# Altium schematic sheet [5] Power, DWIN.SchDoc
size A4; DocumentNumber: 8; SheetNumber: 8; SheetTotal: 10
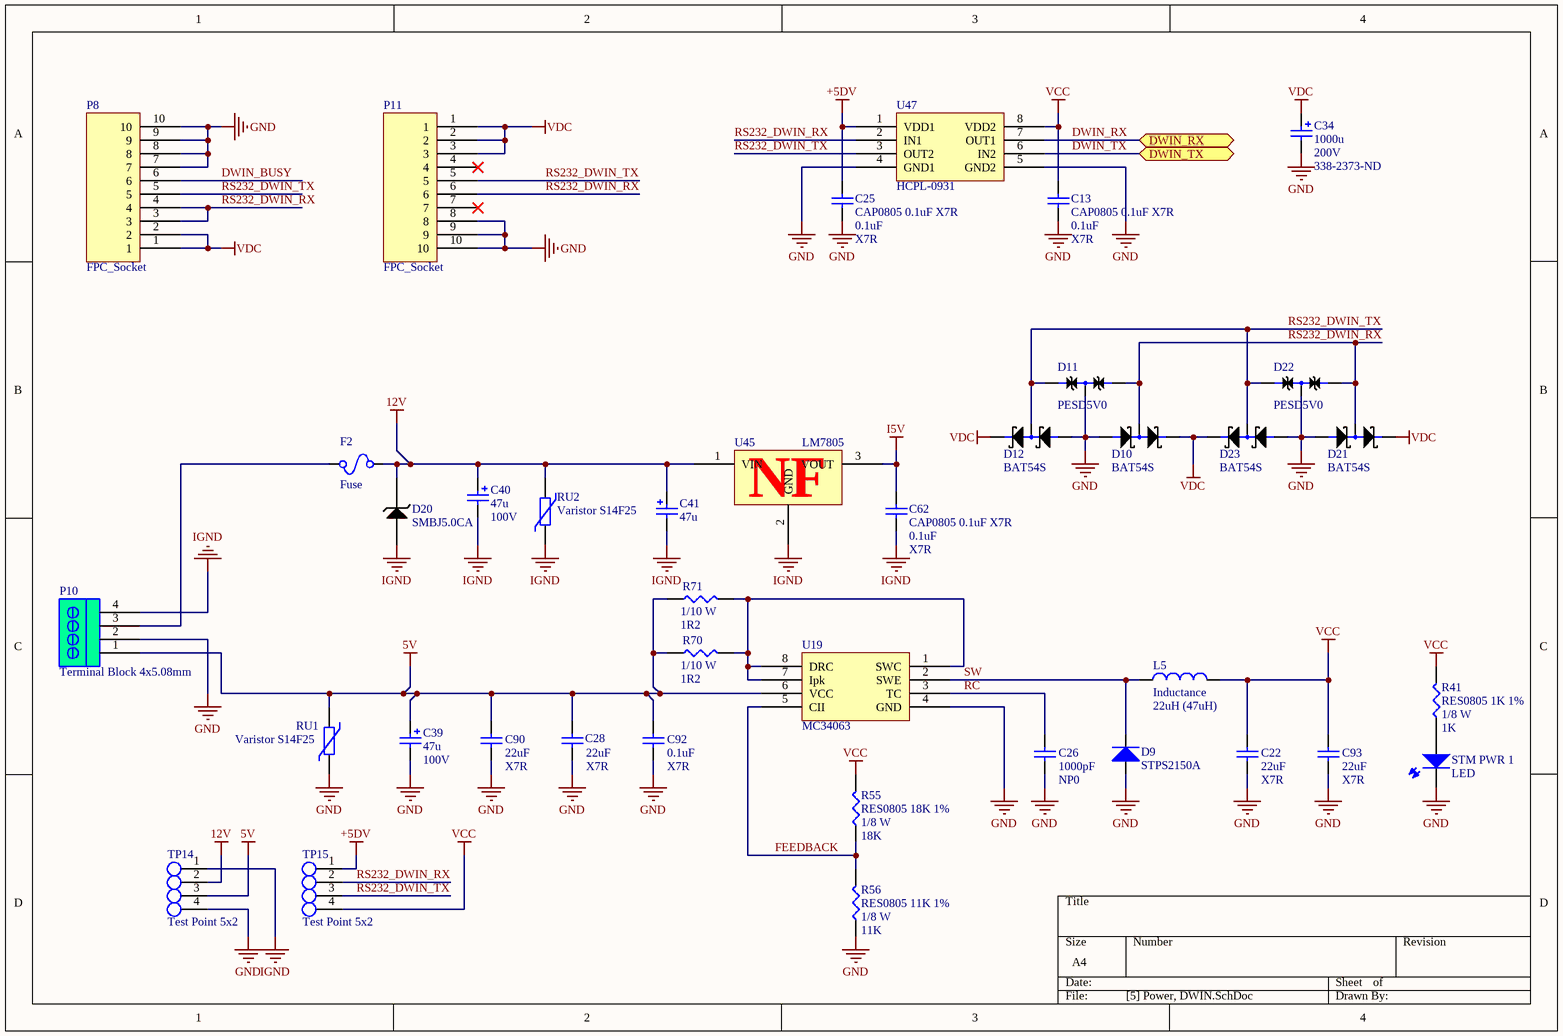
[diagram p0: [5] Power, DWIN.SchDoc]

## Parts
C13  CAP0805 0.1uF X7R  value 0.1uF  Type: X7R  [CAP0805]
C22  value 22uF  Type: X7R  [CAP1210]  (hidden comment: ChipCap 22u X7R)
C25  CAP0805 0.1uF X7R  value 0.1uF  Type: X7R  [CAP0805]
C26  value 1000pF  Type: NP0  [CAP0805]  (hidden comment: CAP0805 1000pF NP0)
C28  value 22uF  Type: X7R  [CAP1210]  (hidden comment: ChipCap 22u X7R)
C34  value 1000u  Voltage: 200V  Supplier Part Number 1: 338-2373-ND  [CAPPR7.5-16x25_1]  (hidden comment: Cap Pol 200/100)
C39  value 47u  Voltage: 100V  [CAPPR5-10x17_1]  (hidden comment: Cap Pol 100/47)
C40  value 47u  Voltage: 100V  [CAPPR5-10x17_1]  (hidden comment: Cap Pol 100/47)
C41  value 47u  [CAPC7343]  (hidden comment: Cap Pol SMD)
C62  CAP0805 0.1uF X7R  value 0.1uF  Type: X7R  [CAP0805]
C90  value 22uF  Type: X7R  [CAP1210]  (hidden comment: ChipCap 22u X7R)
C92  value 0.1uF  Type: X7R  [CAP0603]  (hidden comment: ChipCap 0.1u X7R)
C93  value 22uF  Type: X7R  [CAP1210]  (hidden comment: ChipCap 22u X7R)
D9  STPS2150A  [DO-214AS]
D10  BAT54S  [SOT23]
D11  PESD5V0  [SOT23]
D12  BAT54S  [SOT23]
D20  SMBJ5.0CA  [DO-214AS]
D21  BAT54S  [SOT23]
D22  PESD5V0  [SOT23]
D23  BAT54S  [SOT23]
F2  Fuse  [PTC1812]
L5  Inductance  value 22uH (47uH)  [IHPL-3232]
P8  FPC_Socket  [MOLEX Header 8 2mm Pitch]
P10  Terminal Block 4x5.08mm  [Socket 4x5.08]
P11  FPC_Socket  [Molex FPC/FFC 10pin]
R41  RES0805 1K 1%  value 1K  Rating: 1/8 W  [RES0805]
R55  RES0805 18K 1%  value 18K  Rating: 1/8 W  [RES0805]
R56  RES0805 11K 1%  value 11K  Rating: 1/8 W  [RES0805]
R70  value 1R2  Rating: 1/10 W  [RES1206]  (hidden comment: ChipRes 1R2 1%)
R71  value 1R2  Rating: 1/10 W  [RES1206]  (hidden comment: ChipRes 1R2 1%)
RU1  Varistor S14F25  [S14K25]
RU2  Varistor S14F25  [S14K25]
STM_PWR_1  LED  [PLCC-2]
TP14  Test Point 5x2  [PG-1.5-13.5-4P-2.54PH]
TP15  Test Point 5x2  [PG-1.5-13.5-4P-2.54PH]
U19  MC34063  [SOP8]
U45  LM7805  [TO-220]
U47  HCPL-0931  [SOIC8]

## Ports
DWIN_RX, DWIN_TX

## Nets
5V: C28.2 C39.1 C90.2 C92.2 P10.1 R70.1 R71.1 RU1.2 TP14.3 U19.6(VCC)
12V: C40.1 C41.1 D20.1 F2.1 RU2.2 TP14.2 U45.1(VIN)
+5DV: C25.2 TP15.1 U47.1(VDD1)
GND: C13.1 C22.1 C25.1 C26.1 C28.1 C34.2 C39.2 C90.1 C92.1 C93.1 D9.1(A) D10.1 D11.3 D12.1 D21.1 D22.3 D23.1 P8.7 P8.8 P8.9 P8.10 P10.2 P11.8 P11.9 P11.10 R56.1 RU1.1 STM_PWR_1.1 TP14.4 U19.4(GND) U47.4(GND1) U47.5(GND2)
I5V: C62.2 U45.3(VOUT)
IGND: C40.2 C41.2 C62.1 D20.2 P10.4 RU2.1 TP14.1 U45.2(GND)
VCC: C13.2 C22.2 C93.2 L5.1 R41.2 R55.2 TP15.4 U47.8(VDD2)
VDC: C34.1 D10.2 D12.2 D21.2 D23.2 P8.1 P8.2 P11.1 P11.2 P11.3
DWIN_BUSY: P8.6
DWIN_RX: U47.7(OUT1) ; port DWIN_RX
DWIN_TX: U47.6(IN2) ; port DWIN_TX
FEEDBACK: R55.1 R56.2 U19.5(CII)
RC: C26.2 U19.3(TC)
RS232_DWIN_RX: D10.3 D11.2 D21.3 D22.2 P8.3 P8.4 P11.6 TP15.2 U47.2(IN1)
RS232_DWIN_TX: D11.1 D12.3 D22.1 D23.3 P8.5 P11.5 TP15.3 U47.3(OUT2)
SW: D9.2(K) L5.2 U19.2(SWE)
NetF2_2: F2.2 P10.3
NetR41_1: R41.1 STM_PWR_1.2
NetR70_2: R70.2 R71.2 U19.1(SWC) U19.7(Ipk) U19.8(DRC)

Not connected (* = marked no-connect by the designer): P11 4* 7*

## Notes on the sheet
- (near U45) NF

## Library data of the parts
C13 C25 C62 = CAP0805 0.1uF X7R: Surface-mount ceramic multilayer capacitor; Manufacturer: YAGEO; Manufacturer Part Number: CC0805JRX7R9BB104; Voltage: 50V; Tolerance: 5%; ComponentLink1Description: Datasheet; ComponentLink1URL: http://www.deaha.com/pdf/YAGEO-CC_series.pdf
C22 C28 C90 C93 = ChipCap 22uF X7R: Surface-mount ceramic multilayer capacitor; Manufacturer: YAGEO; Voltage: 25V; Tolerance: 10%; ComponentLink1Description: Datasheet; ComponentLink1URL: http://www.deaha.com/pdf/YAGEO-CC_series.pdf
C26 = CAP0805 1000pF NP0: Surface-mount ceramic multilayer capacitor; Manufacturer: YAGEO; Manufacturer Part Number: CC0805JRNPO9BN102; Voltage: 50V; Tolerance: 5%; ComponentLink1Description: Datasheet; ComponentLink1URL: http://www.deaha.com/pdf/YAGEO-CC_series.pdf
C34 = Cap Pol 200/100: Polarized Capacitor (Radial); Supplier 1: Digi-Key
C39 C40 = Cap Pol 100/47: Polarized Capacitor (Radial); Supplier 1: Digi-Key; Supplier Part Number 1: P1284-ND
C41 = Cap Pol Chip: Polarized Capacitor (Radial); Supplier 1: Digi-Key; Supplier Part Number 1: 399-4029-1-ND
C92 = ChipCap 0.1uF X7R: Surface-mount ceramic multilayer capacitor; Manufacturer: YAGEO; Voltage: 100V; Tolerance: 10%; ComponentLink1Description: Datasheet; ComponentLink1URL: http://www.deaha.com/pdf/YAGEO-CC_series.pdf
D9 = STPS2150A: Schottky diode; Manufacturer: ST; Voltage: 150V; Max current: 2A; Manufacturer Part Number: STPS2150A; Category: Schottky diods
D10 D12 D21 D23 = BAT54S: Small signal schottky dual diode; Manufacturer Part Number: BAT54S-V-GS08; Voltage: 30; Max current: 200mA
D11 D22 = PESD5V0: Low capacitance bidirectional double ESD protection diode; Manufacturer Part Number: PESD5V0S2BT.215; Manufacturer: NXP; Voltage: 5V; ESD: 15kV; Complies with: IEC 61000-4-2: level 4, IEC 61000-4-5 Ipp = 12A; Peak pulse power: 130W; Peak pulse current: 12A; Category: TVS; Package: SOT23-3
D20 = SMBJ5.0CA: Transient Voltage Suppressor 600W uni-directional; Max current: 60A; Tj: 175; Voltage: 5.0V; Manufacturer Part Number: SMBJ5.0CA; Peak pulse power dissipation: 600W
F2 = Fuse PTC1812: Fuse PTC 1812 Thermoresistor
L5 = ChipInductance
P10 = Socket_4x5.08_RA_2Wall: Terminal Block Socket Right Angle 4x5.08mm 2-Wall
R41 = RES0805 1K 1%: Think Film Chip resistor; Manufacturer Part Number: RC0805FR-071KL; Temperature Coefficient: 100ppm/K; Tolerance: 1%; Type: ThickFilm
R55 = RES0805 18K 1%: Think Film Chip resistor; Manufacturer Part Number: RC0805FR-0718KL; Temperature Coefficient: 100ppm/K; Tolerance: 1%; Type: ThickFilm
R56 = RES0805 11K 1%: Think Film Chip resistor; Manufacturer Part Number: RC0805FR-0711KL; Temperature Coefficient: 100ppm/K; Tolerance: 1%; Type: ThickFilm
R70 R71 = ChipRes 1R2 1%: Think Film Chip resistor; Temperature Coefficient: 200ppm/K; Tolerance: 1%; Type: ThickFilm
RU1 RU2 = Varistor S14K25: varistor
STM_PWR_1 = LED0603
TP14 TP15 = PG-1.5-13.5-4P-2.54PH
U19 = MC34063: DC/DC converter control circuit; ComponentLink1Description: Datasheet; ComponentLink1URL: https://www.terraelectronica.ru/show_pdf.php?pdf=%2Fds%2Fpdf%2Fm%2Fmc34063acd-tr.pdf; HelpURL: MC34063; Supplier 1: Terraelectronica; Supplier Part Number 1: 356799; Supplier 2: Elgrad; Supplier Part Number 2: 30445; Supplier 3: Compel; Supplier Part Number 3: MC34063AG- S08-T(R)
U45 = LM7805: Linear voltage regulator 1A
U47 = HCPL-0931-000E: 2-bit bi-direction optoisolated buffer